# EAGLE design VisualightMicroDIY_035_gnd (EAGLE 6.2)
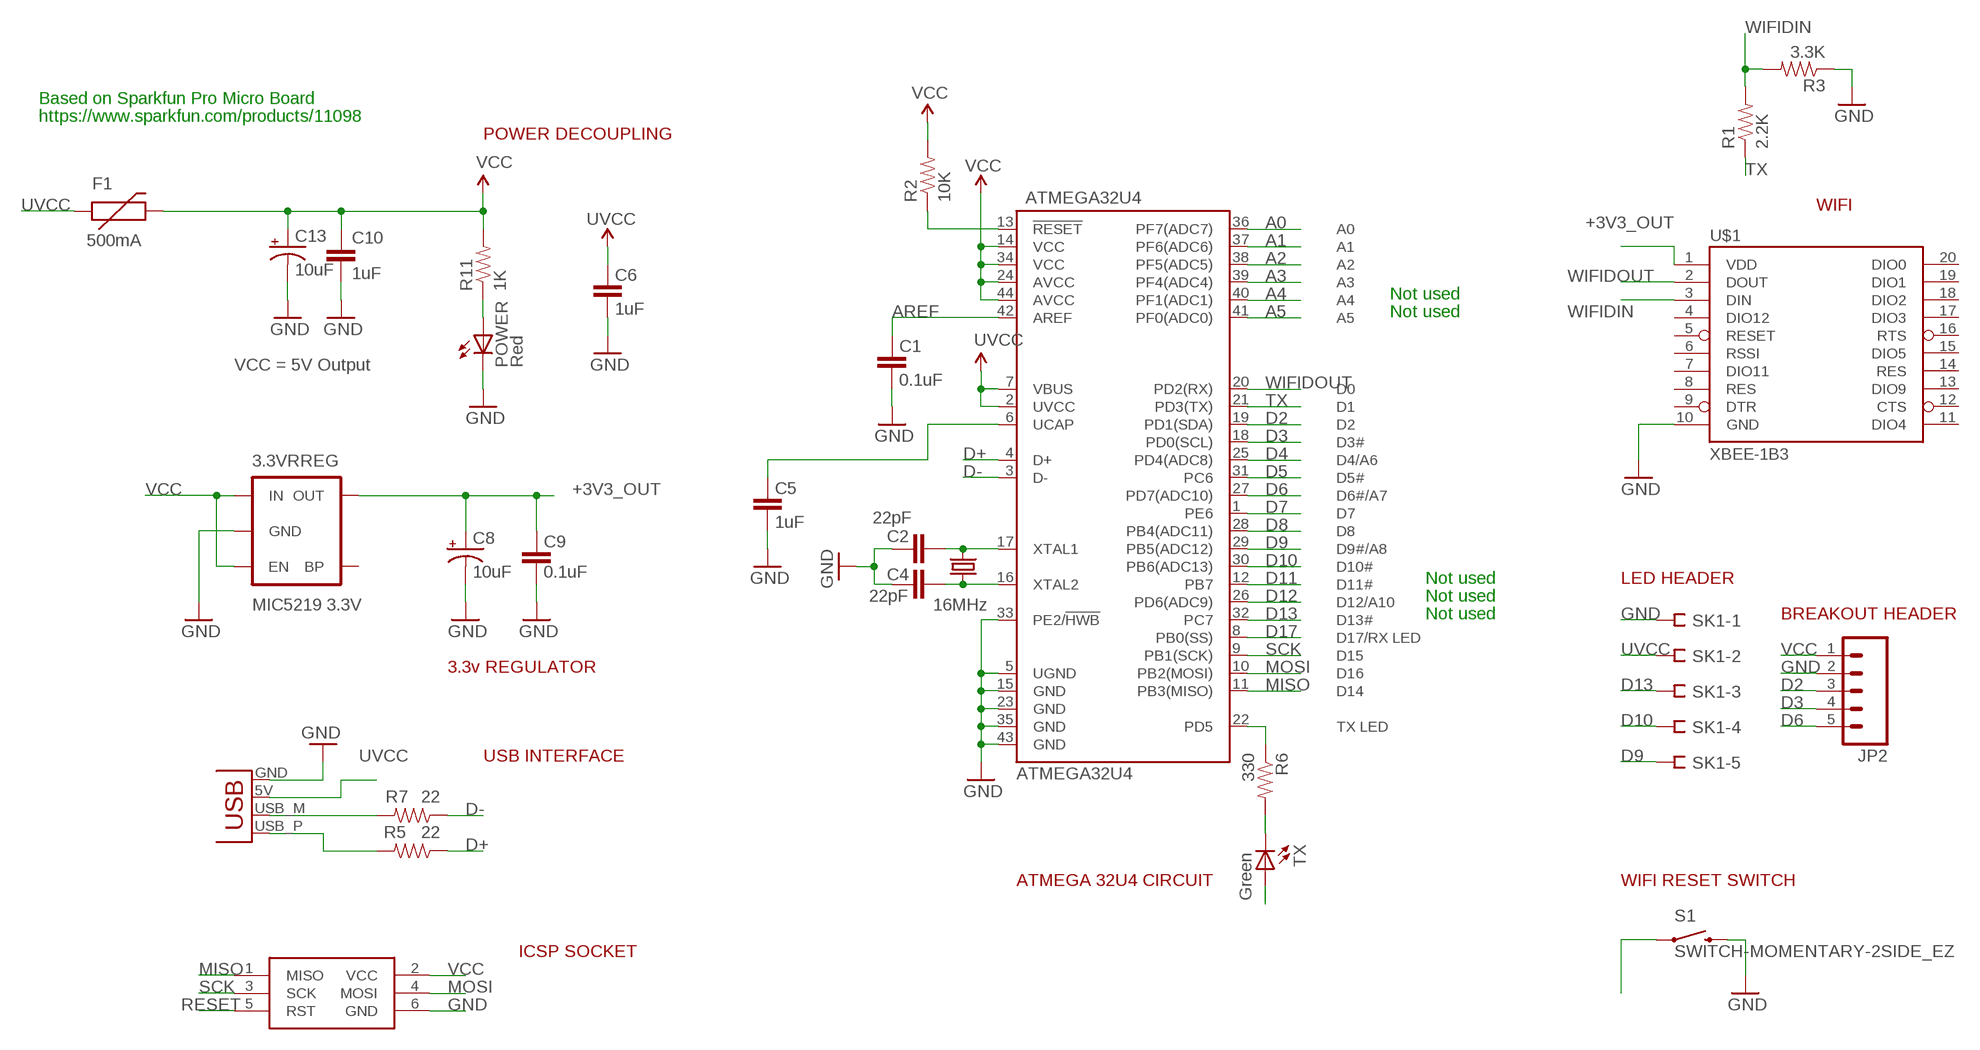
[diagram p0: schematic, sheet 1]

## Parts
3.3VRREG  MIC5219 3.3V  V_REG_MIC52193.3V  [SOT23-5]
ATMEGA32U4  ATMEGA32U4  ATMEGA32U4TQFP  [SPARKFUN-DIGITALIC_TQFP44]
C1  0.1uF  CAP0402-CAP  [0402-CAP]
C2  22pF  CAP0402-CAP  [0402-CAP]
C4  22pF  CAP0402-CAP  [0402-CAP]
C5  1uF  CAP0402-CAP  [0402-CAP]
C6  1uF  CAP0402-CAP  [0402-CAP]
C8  10uF  CAP_POL1206  [EIA3216]
C9  0.1uF  CAP0402-CAP  [0402-CAP]
C10  1uF  CAP0402-CAP  [0402-CAP]
C13  10uF  CAP_POL1206  [EIA3216]
F1  500mA  PTCSMD  [PTC-1206]
ISP1  AVRISP-6  [AVRISP]
JP2  M05PTH  [1X05]
POWER  Red  LED0603  [LED-0603]
R1  2.2K  RESISTOR0402-RES  [0402-RES]
R2  10K  RESISTOR0402-RES  [0402-RES]
R3  3.3K  RESISTOR0402-RES  [0402-RES]
R5  22  RESISTOR0402-RES  [0402-RES]
R6  330  RESISTOR0402-RES  [0402-RES]
R7  22  RESISTOR0402-RES  [0402-RES]
R11  1K  RESISTOR0402-RES  [0402-RES]
S1  SWITCH-MOMENTARY-2SIDE_EZ  [TACTILE-PTH-SIDEEZ]
SK1  DF3-05S  [DF3S-05]
TX  Green  LED0603  [LED-0603]
U$1  XBEE-1B3  [XBEE-SMD]
X2  USBPCB  [USB-A-PCB]
Y1  16MHz  CRYSTAL5X3  [CRYSTAL-SMD-5X3]

## Nets
+3V3_OUT: 3.3VRREG.5(OUT) C8.A(+) C9.2 U$1.1(VDD)
A0: ATMEGA32U4.36(PF7(ADC7))
A1: ATMEGA32U4.37(PF6(ADC6))
A2: ATMEGA32U4.38(PF5(ADC5))
A3: ATMEGA32U4.39(PF4(ADC4))
A4: ATMEGA32U4.40(PF1(ADC1))
A5: ATMEGA32U4.41(PF0(ADC0))
AREF: ATMEGA32U4.42(AREF) C1.2
D2: ATMEGA32U4.19(PD1(SDA)) JP2.3
D3: ATMEGA32U4.18(PD0(SCL)) JP2.4
D4: ATMEGA32U4.25(PD4(ADC8))
D5: ATMEGA32U4.31(PC6)
D6: ATMEGA32U4.27(PD7(ADC10)) JP2.5
D7: ATMEGA32U4.1(PE6) S1.1
D8: ATMEGA32U4.28(PB4(ADC11))
D9: ATMEGA32U4.29(PB5(ADC12)) SK1.5
D10: ATMEGA32U4.30(PB6(ADC13)) SK1.4
D11: ATMEGA32U4.12(PB7)
D12: ATMEGA32U4.26(PD6(ADC9))
D13: ATMEGA32U4.32(PC7) SK1.3
D17: ATMEGA32U4.8(PB0(SS))
D+: ATMEGA32U4.4(D+) R5.1
D-: ATMEGA32U4.3(D-) R7.1
GND [vcc]: 3.3VRREG.2(GND) ATMEGA32U4.5(UGND) ATMEGA32U4.15(GND) ATMEGA32U4.23(GND) ATMEGA32U4.33(PE2/!HWB) ATMEGA32U4.35(GND) ATMEGA32U4.43(GND) C1.1 C2.2 C4.2 C5.1 C6.1 C8.C(-) C9.1 C10.2 C13.C(-) ISP1.6(GND) JP2.2 POWER.C R3.1 S1.2 SK1.1 U$1.10(GND) X2.GND
MISO: ATMEGA32U4.11(PB3(MISO)) ISP1.1(MISO)
MOSI: ATMEGA32U4.10(PB2(MOSI)) ISP1.4(MOSI)
N$1: ATMEGA32U4.16(XTAL2) C4.1 Y1.1
N$2: ATMEGA32U4.17(XTAL1) C2.1 Y1.3
N$4: ATMEGA32U4.6(UCAP) C5.2
N$6: R7.2 X2.USB_M(D-)
N$7: R6.2 TX.C
N$8: R5.2 X2.USB_P(D+)
N$38: POWER.A R11.1
RESET: ATMEGA32U4.13(!RESET) ISP1.5(RST) R2.1
SCK: ATMEGA32U4.9(PB1(SCK)) ISP1.3(SCK)
TX: ATMEGA32U4.21(PD3(TX)) R1.1
TXLED: ATMEGA32U4.22(PD5) R6.1
UVCC: ATMEGA32U4.2(UVCC) ATMEGA32U4.7(VBUS) C6.2 F1.1 SK1.2 X2.5V(VBUS)
VCC: 3.3VRREG.1(IN) 3.3VRREG.3(EN) ATMEGA32U4.14(VCC) ATMEGA32U4.24(AVCC) ATMEGA32U4.34(VCC) ATMEGA32U4.44(AVCC) C10.1 C13.A(+) F1.2 ISP1.2(VCC) JP2.1 R2.2 R11.2 TX.A
WIFIDIN: R1.2 R3.2 U$1.3(DIN)
WIFIDOUT: ATMEGA32U4.20(PD2(RX)) U$1.2(DOUT)
Unconnected: 3.3VRREG.4(BP) U$1.4(DIO12) U$1.5(RESET) U$1.6(RSSI) U$1.7(DIO11) U$1.8(RES) U$1.9(DTR) U$1.11(DIO4) U$1.12(CTS) U$1.13(DIO9) U$1.14(RES) U$1.15(DIO5) U$1.16(RTS) U$1.17(DIO3) U$1.18(DIO2) U$1.19(DIO1) U$1.20(DIO0)

## Notes on the sheet
- Based on Sparkfun Pro Micro Board
- https://www.sparkfun.com/products/11098
- POWER DECOUPLING
- WIFI
- Not used
- Not used
- VCC = 5V Output
- Not used | LED HEADER
- Not used
- Not used | BREAKOUT HEADER
- 3.3v REGULATOR
- USB INTERFACE
- ATMEGA 32U4 CIRCUIT | WIFI RESET SWITCH
- ICSP SOCKET

## Library data of the parts
3.3VRREG = SparkFun-PowerIC:V_REG_MIC5219: V_REG MIC5219 Standard 500mA LDO voltage regulator in SOT-23 layout. Micrel part MIC5219. BP (by-pass) pin is used to lower output noise with 470pF cap, may be left open.; PROD_ID: VREG-09872
ATMEGA32U4 = SparkFun-DigitalIC:ATMEGA32U4: Atmel 44-pin 8-bit Microcontroller with 32KBytes of ISP Flash and USB Controller
C1 C2 C4-C6 C9 C10 = SparkFun:CAP: Capacitor Standard 0603 ceramic capacitor, and 0.1" leaded capacitor.
C8 C13 = SparkFun:CAP_POL: Capacitor Polarized These are standard SMD and PTH capacitors. Normally 10uF, 47uF, and 100uF in electrolytic and tantalum varieties. Always verify the external diameter of the through hole cap, it varies with capacity, voltage, and manufacturer. The EIA devices should be standard.
F1 = SparkFun:PTC: Resettable Fuse PTC Resettable Fuse. Spark Fun Electronics SKU : COM-08357
ISP1 = adafruit:AVRISP: AVR ISP HEADER Standard 6 pin header for AVR programming
JP2 = SparkFun-Connectors:M05: Header 5 Standard 5-pin 0.1" header. Use with straight break away headers (SKU : PRT-00116), right angle break away headers (PRT-00553), swiss pins (PRT-00743), machine pins (PRT-00117), and female headers (PRT-00115). Molex polarized connector foot print use with SKU : PRT-08230 with associated crimp pins and housings.
POWER TX = SparkFun:LED: LEDs Standard schematic elements and footprints for 5mm, 3mm, 1206, and 0603 sized LEDs. 5mm - Spark Fun Electronics SKU : COM-00529 (and others)
R1-R3 R5-R7 R11 = SparkFun:RESISTOR: Resistor Basic schematic elements and footprints for 0603, 1206, and PTH resistors.
S1 = SparkFun-Electromechanical:SWITCH-MOMENTARY-2: Various NO switches- pushbuttons, reed, etc
SK1 = con-hirose-df3:DF3-05S: Single row female connector 2mm 5 way
U$1 = SparkFun-RF:XBEE-1: Xbee module footprints SMT header is CONN-09042.; PROD_ID: CONN-09042
X2 = SparkFun-Connectors:USB: USB Connectors USB-B-PTH is fully proven SKU : PRT-00139/CONN-08278 USB-miniB is fully proven SKU : PRT-00587 USB-A-PCB is untested. USB-A-H is throughly reviewed, but untested. Spark Fun Electronics SKU : PRT-00437 USB-B-SMT is throughly reviewed, but untested. Needs silkscreen touching up. USB-A-S has not been used/tested USB-MB-H has not been used/tested USB-MICROB has been used. CONN-09505
Y1 = SparkFun:CRYSTAL: Crystals Various standard crystals. Proven footprints. Spark Fun Electronics SKU : COM-00534

## Net classes
0 default: width 0.003 mm, drill 0.254 mm, clearance 0.152 mm

## Board
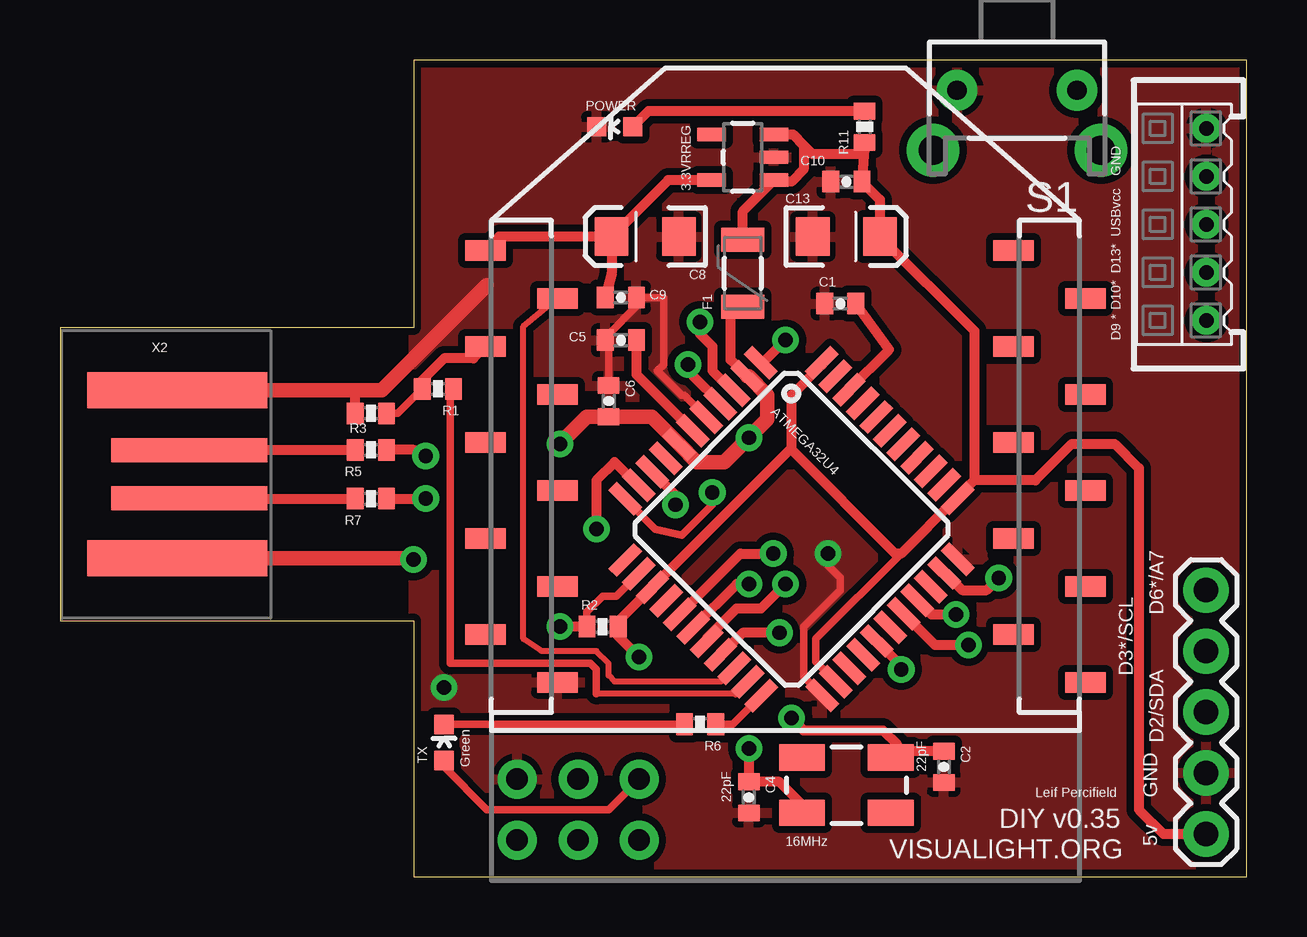
[diagram p1: board, top side]
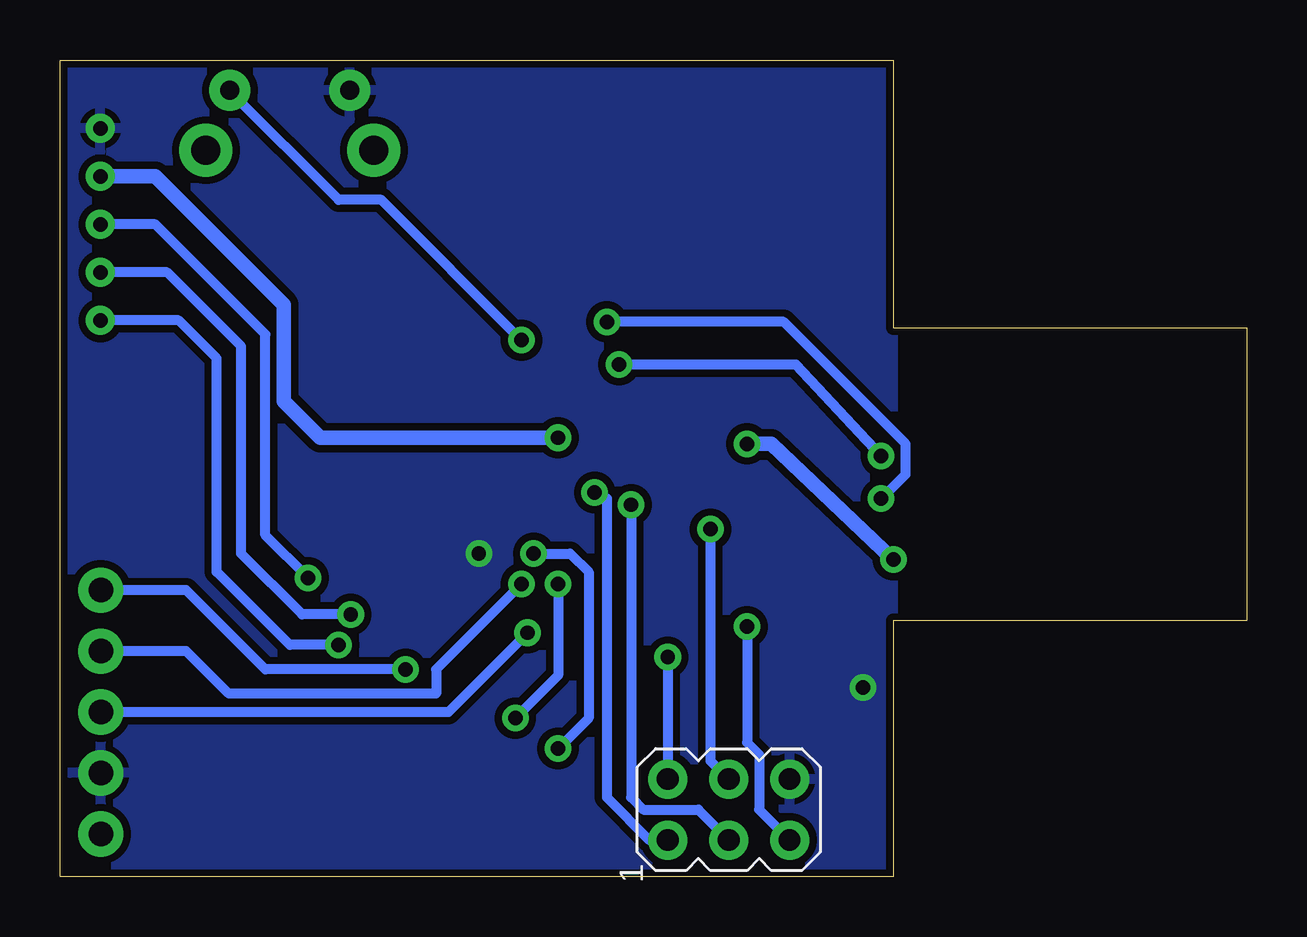
[diagram p2: board, bottom side, seen from below]

Size 49.45 x 34.03 mm. Coordinates in mm from the lower left corner, seen from the top.
Outline: 14.73,0 49.45,0 49.45,34.03 14.73,34.03 14.73,22.86 0,22.86 0,10.67 14.73,10.67 14.73,0
Copper layers (1*16): Top 0.035mm / dielectric 1.5mm / Bottom 0.035mm
Design rules: minimum track width 8mil, minimum drill 20mil, track to track 8mil, track to pad 8mil, pad to pad 8mil, via to via 8mil, smd to smd 8mil, copper to edge 10mil, drill to drill 8mil, minimum pad ring 12mil, minimum via ring 10mil, stop-mask expansion 4mil, vias tented up to drill 25mil, thermal gap 10mil

### Footprints (pad centres in the part's own frame; a part is rotated, then mirrored left to right if it is on the bottom)
SOT23-5 = smd 0.55 x 1.2: 1 -0.95,-1.3; 2 0,-1.3; 3 0.95,-1.3; 4 0.95,1.3; 5 -0.95,1.3
SPARKFUN-DIGITALIC_TQFP44 = smd 1.5 x 0.5: 1 -5.8,4; 2 -5.8,3.2; 3 -5.8,2.4; 4 -5.8,1.6; 5 -5.8,0.8; 6 -5.8,0; 7 -5.8,-0.8; 8 -5.8,-1.6; 9 -5.8,-2.4; 10 -5.8,-3.2; 11 -5.8,-4; 23 5.8,-4; 24 5.8,-3.2; 25 5.8,-2.4; 26 5.8,-1.6; 27 5.8,-0.8; 28 5.8,0; 29 5.8,0.8; 30 5.8,1.6; 31 5.8,2.4; 32 5.8,3.2; 33 5.8,4 | smd 0.5 x 1.5: 12 -4,-5.8; 13 -3.2,-5.8; 14 -2.4,-5.8; 15 -1.6,-5.8; 16 -0.8,-5.8; 17 0,-5.8; 18 0.8,-5.8; 19 1.6,-5.8; 20 2.4,-5.8; 21 3.2,-5.8; 22 4,-5.8; 34 4,5.8; 35 3.2,5.8; 36 2.4,5.8; 37 1.6,5.8; 38 0.8,5.8; 39 0,5.8; 40 -0.8,5.8; 41 -1.6,5.8; 42 -2.4,5.8; 43 -3.2,5.8; 44 -4,5.8
0402-CAP = smd 0.7 x 0.9: 1 -0.65,0; 2 0.65,0
EIA3216 = smd 1.4 x 1.6: A 1.4,0; C -1.4,0
PTC-1206 = smd 1 x 1.8: 1 -1.4,0; 2 1.4,0
AVRISP = drill 0.9 pad 1.626: 1 -1.27,2.54; 2 1.27,2.54; 3 -1.27,0; 4 1.27,0; 5 -1.27,-2.54; 6 1.27,-2.54
1X05 = drill 1.016 pad 1.88: 1 0,0; 2 2.54,0; 3 5.08,0; 4 7.62,0; 5 10.16,0
LED-0603 = smd 0.8 x 0.8: A 0,-0.75; C 0,0.75
0402-RES = smd 0.7 x 0.9: 1 -0.65,0; 2 0.65,0
TACTILE-PTH-SIDEEZ = drill 0.8 pad 1.7: 1 -2.5,0; 2 2.5,0 | drill 1.2 pad 2.2: ANCHOR1 -3.5,2.5; ANCHOR2 3.5,2.5
DF3S-05 = drill 0.6: 1 -4,1.032; 2 -2,1.032; 3 0,1.032; 4 2,1.032; 5 4,1.032
XBEE-SMD = smd 1.7 x 0.85: 1 -12.5,20; 2 -9.5,18; 3 -12.5,16; 4 -9.5,14; 5 -12.5,12; 6 -9.5,10; 7 -12.5,8; 8 -9.5,6; 9 -12.5,4; 10 -9.5,2; 11 12.5,2; 12 9.5,4; 13 12.5,6; 14 9.5,8; 15 12.5,10; 16 9.5,12; 17 12.5,14; 18 9.5,16; 19 12.5,18; 20 9.5,20
USB-A-PCB = smd 7.5 x 1.5: 5V -0.2,-3.5; GND -0.2,3.5 | smd 6.5 x 1: USB_M 0.3,-1; USB_P 0.3,1
CRYSTAL-SMD-5X3 = smd 1.9 x 1.1: 1 -1.85,-1.15; 2 1.85,-1.15; 3 1.85,1.15; 4 -1.85,1.15

### Placement (x,y rotation side)
3.3VRREG  28.45,29.97 90 top
ATMEGA32U4  30.48,14.48 315.1 top
C1  32.51,23.88 0 top
C2  36.83,4.57 270 top
C4  28.7,3.3 270 top
C5  23.37,22.35 0 top
C6  22.86,19.81 270 top
C8  24.38,26.67 180 top
C9  23.37,24.13 180 top
C10  32.77,28.96 180 top
C13  32.77,26.67 0 top
F1  28.45,25.15 90 top
ISP1  21.59,2.79 90 bottom
JP2  47.75,1.78 90 top
POWER  23.11,31.24 90 top
R1  15.75,20.32 180 top
R2  22.61,10.41 0 top
R3  12.95,19.3 0 top
R5  12.95,17.78 180 top
R6  26.67,6.35 180 top
R7  12.95,15.75 180 top
R11  33.53,31.24 270 top
S1  39.88,32.77 180 top
SK1  46.74,27.18 270 top
TX  16,5.59 0 top
U$1  30.23,6.1 0 top
X2  5.08,16.76 0 top
Y1  32.77,3.81 0 top

### Tracks (layer width: path | path; a pad name or v marks a point on that pad's centre or on a via)
+3V3_OUT
  Top 0.406: C8.A 22.98,25.13 C9.2 | C8.A 18.3,26.67 U$1.1 | 3.3VRREG.5 25.34,29.02 C8.A
AREF
  Top 0.406: ATMEGA32U4.42 34.55,21.96 C1.2
D2  (via drill 0.6)
  Top 0.406: ATMEGA32U4.19 28.44,10.16 v29.97,10.16
  Bottom 0.406: v29.97,10.16 33.27,6.86 JP2.3
D3  (via drill 0.6)
  Top 0.406: ATMEGA32U4.18 26.95,9.94 28.19,11.18 29.21,11.18 v30.23,12.19
  Bottom 0.406: v30.23,12.19 33.78,8.64 33.78,7.62 42.42,7.62 44.2,9.4 JP2.4
D6  (via drill 0.6)
  Top 0.406: ATMEGA32U4.27 35.05,8.79 v35.05,8.64
  Bottom 0.406: v35.05,8.64 40.89,8.64 44.2,11.94 JP2.5
D7  (via drill 0.6)
  Top 0.406: ATMEGA32U4.1 29.28,21.41 v30.23,22.35
  Bottom 0.406: v30.23,22.35 36.07,28.19 37.85,28.19 42.38,32.73 S1.1
D9  (via drill 0.6)
  Top 0.406: ATMEGA32U4.29 36.45,9.65 v37.85,9.65
  Bottom 0.406: v37.85,9.65 39.88,9.65 42.93,12.7 42.93,21.59 44.51,23.18 SK1.5
D10  (via drill 0.6)
  Top 0.406: ATMEGA32U4.30 36.31,10.92 v37.34,10.92
  Bottom 0.406: v37.34,10.92 39.37,10.92 41.91,13.46 41.91,22.1 44.99,25.18 SK1.4
D13  (via drill 0.6)
  Top 0.406: ATMEGA32U4.32 36.88,12.65 37.59,11.94 38.61,11.94 v39.12,12.45
  Bottom 0.406: v39.12,12.45 40.89,14.22 40.89,22.59 45.48,27.18 SK1.3
D+  (via drill 0.6)
  Top 0.406: ATMEGA32U4.4 27.5,19.74 26.42,20.83 v26.16,21.34 | v15.24,17.53 14.73,17.78 R5.1
  Bottom 0.406: v15.24,17.53 18.8,21.34 v26.16,21.34
D-  (via drill 0.6)
  Top 0.406: R7.1 v15.24,15.75 | v26.67,23.11 26.67,22.61 27.18,22.1 27.18,21.08 27.99,20.27 ATMEGA32U4.3
  Bottom 0.406: v15.24,15.75 14.22,16.76 14.22,18.03 19.3,23.11 v26.67,23.11
GND  (via drill 0.6)
  Top 0.305: ATMEGA32U4.23 30.99,8.33 30.99,10.41 32.51,11.94 32.51,12.45 32,12.95 v32,13.46 | ATMEGA32U4.5 26.01,20.07 25.91,20.07 24.89,21.08 25.15,21.34 25.15,24.13 C9.1 24.02,23.76 22.86,22.61 C6.1
  Top 0.406: R3.1 12.3,20.12 11.94,20.26
  Top 0.61: X2.GND 11.94,20.26 13.41,20.26 17.78,24.64
  other vias: 16,7.87
  pour Top (isolate 0.305): 14.73,34.04 49.53,34.04 49.53,0 14.73,0
  pour Bottom (isolate 0.305): 14.73,34.04 49.53,34.29 49.53,0.25 14.73,0
MISO  (via drill 0.6)
  Top 0.305: ATMEGA32U4.11 24.81,14.48 25.91,14.22 27.18,15.49 v27.18,16
  Bottom 0.406: v27.18,16 26.67,15.75 26.67,3.3 24.89,1.52 ISP1.1
MOSI  (via drill 0.6)
  Top 0.406: ATMEGA32U4.10 24.08,16.3 23.11,17.27 22.35,16.51 v22.35,14.48
  Bottom 0.406: v22.35,14.48 22.35,4.83 ISP1.4
N$1  (via drill 0.6)
  Top 0.406: Y1.1 30.92,3.01 29.97,3.95 C4.1 v28.7,5.33 | ATMEGA32U4.16 28.35,13.46 v29.72,13.46
  Bottom 0.406: v29.72,13.46 28.19,13.46 27.43,12.7 27.43,6.6 v28.7,5.33
N$2  (via drill 0.6)
  Top 0.406: C2.1 34.88,5.22 | 34.88,5.22 Y1.3 | ATMEGA32U4.17 28.19,12.19 v28.7,12.19 | v30.48,6.6 30.99,6.1 34.29,6.1 34.88,5.51 34.88,5.22
  Bottom 0.406: v28.7,12.19 28.7,8.38 v30.48,6.6
N$4
  Top 0.406: C5.2 24.02,20.93 ATMEGA32U4.6
N$6
  Top 0.305: X2.USB_M 5.4,15.75
  Top 0.406: 5.4,15.75 R7.2
N$7
  Top 0.305: R6.2 16.01,6.35 TX.C
N$8
  Top 0.305: X2.USB_P 5.4,17.78
  Top 0.406: 5.4,17.78 R5.2
N$38
  Top 0.406: R11.1 24.51,31.89 POWER.A
RESET  (via drill 0.6)
  Top 0.305: 21.96,10.47 21.96,11.03 22.61,11.68 23.17,11.68 ATMEGA32U4.13
  Top 0.406: 21.96,10.47 R2.1 v20.83,10.41
  Bottom 0.406: v20.83,10.41 20.83,5.59 20.32,5.08 20.32,2.79 ISP1.5
SCK  (via drill 0.6)
  Top 0.406: ATMEGA32U4.9 25.65,15.9 v25.65,15.49
  Bottom 0.406: v25.65,15.49 25.65,3.3 25.15,2.79 22.86,2.79 ISP1.3
TX
  Top 0.254: 28.16,7.62 22.35,7.62
  Top 0.305: ATMEGA32U4.21 28.16,7.62 | 22.35,7.62 22.35,8.64 22.1,8.89 16.26,8.89 16.26,20.32 R1.1
TXLED
  Top 0.305: R6.1 28.02,6.35 ATMEGA32U4.22
UVCC  (via drill 0.6)
  Top 0.406: ATMEGA32U4.2 27.94,21.53 27.94,23.62 28.06,23.75 F1.1
  Top 0.61: ATMEGA32U4.2 28.69,20.84 29.46,20.07 29.46,19.05 v28.7,18.29 27.69,17.27 26.54,17.27 ATMEGA32U4.7 24.65,19.16 C6.2 21.96,19.16 v20.83,18.03 | X2.5V 14.53,13.26 v14.73,13.21
  Bottom 0.61: v28.7,18.29 38.61,18.29 40.13,19.81 40.13,23.83 45.48,29.18 SK1.2 | v14.73,13.21 19.81,18.03 v20.83,18.03
VCC  (via drill 0.6)
  Top 0.305: ATMEGA32U4.24 31.5,8.95 31.5,9.91 35.05,13.46 | ISP1.2 22.86,2.79 17.78,2.79 16,4.57 TX.A
  Top 0.406: 30.44,17.82 ATMEGA32U4.14 23.26,10.63 R2.2 23.26,10.02 v24.13,9.14 | 30.44,17.82 30.48,17.86 30.48,20.07 31.74,21.33 ATMEGA32U4.44 | 30.48,17.78 34.8,13.46 35.05,13.46 37.35,15.76 ATMEGA32U4.34 37.41,15.82 38.1,16.51 | 38.1,16.51 38.1,22.74 C13.A 34.17,28.21 C10.1 R11.2 33.27,30.11 31.36,30.11 30.99,30.48 | F1.2 28.45,27.72 3.3VRREG.1 29.81,28.96 30.48,28.96 30.99,29.46 30.99,30.48 | 3.3VRREG.3 30.55,30.92 30.99,30.48 | 30.48,17.78 | 30.48,17.78 30.44,17.82 | 38.1,16.51 40.64,16.51 42.16,18.03 43.94,18.03 44.96,17.02 44.96,2.79 45.97,1.78 JP2.1
  Bottom 0.406: v24.13,9.14 ISP1.2
WIFIDIN
  Top 0.305: R1.2 14.08,19.3 R3.2
  Top 0.406: U$1.3 17.22,21.59 16,21.59 15.1,20.69 R1.2
WIFIDOUT
  Top 0.254: ATMEGA32U4.20 27.54,8.13 23.11,8.13 22.86,8.38 22.86,8.89 22.35,9.4 20.07,9.4 19.3,9.91 19.3,22.93 U$1.2

### Text on the board
tPlace: GND | USBvcc | D13* | D10* | D9 * | D6*/A7 | D3*/SCL | D2/SDA | Leif Percifield | GND | DIY v0.35 | VISUALIGHT.ORG | 5v